# Altium schematic sheet EXTENSIONS.SchDoc
size 420 x 297 mm; SheetNumber: 24; SheetTotal: 32; DocumentTypeShort: Э3; DocumentInvertoryNumber: ㅤ
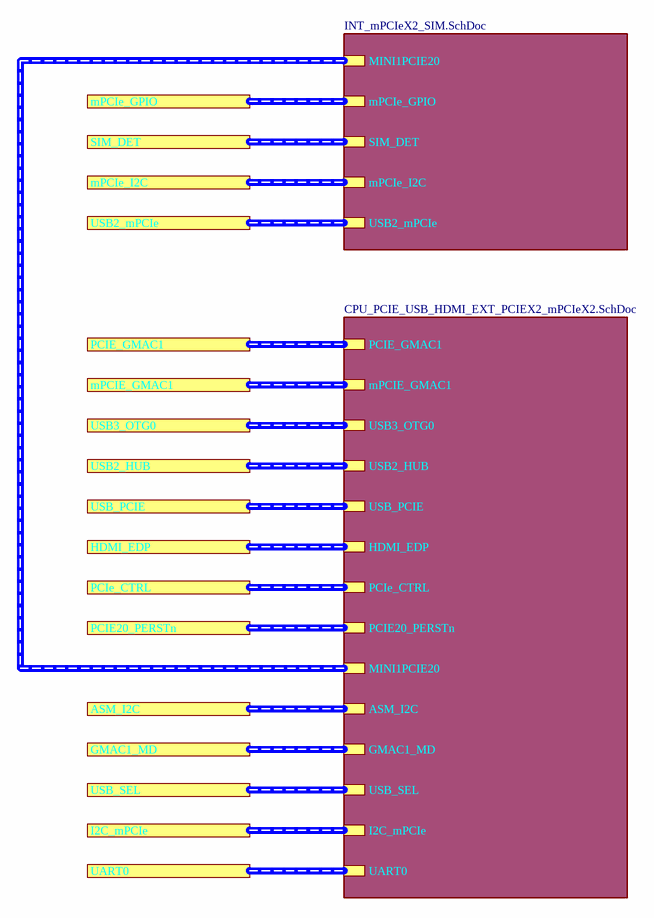
[diagram p0: EXTENSIONS.SchDoc]

## Sub-sheets
CPU_PCIE_USB_HDMI_EXT_PCIEX2_mPCIeX2 = CPU_PCIE_USB_HDMI_EXT_PCIEX2_mPCIeX2.SchDoc: PCIE_GMAC1 (harness PCIE_GMAC1), mPCIE_GMAC1 (harness mPCIE_GMAC1), USB3_OTG0 (harness USB3_OTG0), USB2_HUB (harness USB2_HUB), USB_PCIE (harness USB_PCIE), PCIe_CTRL (harness PCIe_CTRL), MINI1PCIE20 (harness MINI1PCIE20), HDMI_EDP (harness HDMI_EDP), ASM_I2C (harness ASM_I2C), GMAC1_MD (harness GMAC1_MD), PCIE20_PERSTn (harness PCIE20_PERSTn), USB_SEL (harness USB_SEL), I2C_mPCIe (harness I2C_mPCIe), UART0 (harness UART0)
INT_mPCIeX2_SIM = INT_mPCIeX2_SIM.SchDoc: mPCIe_GPIO (harness mPCIe_GPIO), SIM_DET (harness SIM_DET), mPCIe_I2C (harness mPCIe_I2C), USB2_mPCIe (harness USB2_mPCIe), MINI1PCIE20 (harness MINI1PCIE20)

## Ports
ASM_I2C, GMAC1_MD, HDMI_EDP, I2C_mPCIe, mPCIE_GMAC1, mPCIe_GPIO, mPCIe_I2C, PCIE20_PERSTn, PCIe_CTRL, PCIE_GMAC1, SIM_DET, UART0, USB2_HUB, USB2_mPCIe, USB3_OTG0, USB_PCIE, USB_SEL

## Buses and harness runs
harness port ASM_I2C = sheet CPU_PCIE_USB_HDMI_EXT_PCIEX2_mPCIeX2/ASM_I2C
harness port GMAC1_MD = sheet CPU_PCIE_USB_HDMI_EXT_PCIEX2_mPCIeX2/GMAC1_MD
harness port HDMI_EDP = sheet CPU_PCIE_USB_HDMI_EXT_PCIEX2_mPCIeX2/HDMI_EDP
harness port I2C_mPCIe = sheet CPU_PCIE_USB_HDMI_EXT_PCIEX2_mPCIeX2/I2C_mPCIe
harness port mPCIE_GMAC1 = sheet CPU_PCIE_USB_HDMI_EXT_PCIEX2_mPCIeX2/mPCIE_GMAC1
harness port mPCIe_GPIO = sheet INT_mPCIeX2_SIM/mPCIe_GPIO
harness port mPCIe_I2C = sheet INT_mPCIeX2_SIM/mPCIe_I2C
harness port PCIE20_PERSTn = sheet CPU_PCIE_USB_HDMI_EXT_PCIEX2_mPCIeX2/PCIE20_PERSTn
harness port PCIe_CTRL = sheet CPU_PCIE_USB_HDMI_EXT_PCIEX2_mPCIeX2/PCIe_CTRL
harness port PCIE_GMAC1 = sheet CPU_PCIE_USB_HDMI_EXT_PCIEX2_mPCIeX2/PCIE_GMAC1
harness port SIM_DET = sheet INT_mPCIeX2_SIM/SIM_DET
harness port UART0 = sheet CPU_PCIE_USB_HDMI_EXT_PCIEX2_mPCIeX2/UART0
harness port USB2_HUB = sheet CPU_PCIE_USB_HDMI_EXT_PCIEX2_mPCIeX2/USB2_HUB
harness port USB2_mPCIe = sheet INT_mPCIeX2_SIM/USB2_mPCIe
harness port USB3_OTG0 = sheet CPU_PCIE_USB_HDMI_EXT_PCIEX2_mPCIeX2/USB3_OTG0
harness port USB_PCIE = sheet CPU_PCIE_USB_HDMI_EXT_PCIEX2_mPCIeX2/USB_PCIE
harness port USB_SEL = sheet CPU_PCIE_USB_HDMI_EXT_PCIEX2_mPCIeX2/USB_SEL
harness sheet CPU_PCIE_USB_HDMI_EXT_PCIEX2_mPCIeX2/MINI1PCIE20 = sheet INT_mPCIeX2_SIM/MINI1PCIE20

## Notes on the sheet
- Подп. и дата
- Инв. № дубл.
- Взам. инв. №
- Инв. № подл.
- Изм.
- Лист
- № докум.
- Подп.
- Дата
- Копировал
- Формат А3